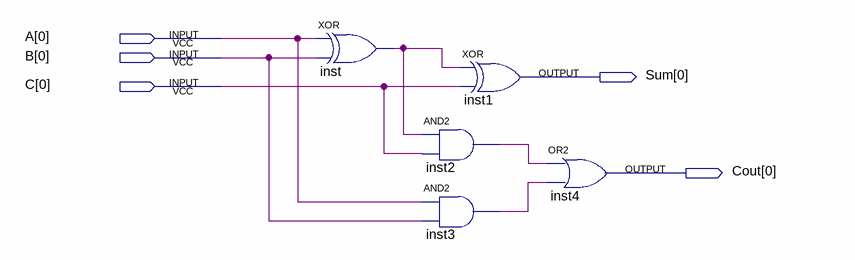
[diagram p0: schematic sheet]
// Quartus schematic Add1.bdf as structural Verilog: 5 symbols, 5 pins
module Add1 (
  input  [0:0] A,
  input  [0:0] B,
  input  [0:0] C,
  output [0:0] Sum,
  output [0:0] Cout
);

  wire inst2_out, inst3_out, inst_out;

  xor inst (inst_out, A[0], B[0]);
  xor inst1 (Sum[0], inst_out, C[0]);
  and inst2 (inst2_out, inst_out, C[0]);
  and inst3 (inst3_out, A[0], B[0]);
  or inst4 (Cout[0], inst2_out, inst3_out);
endmodule
